# EasyEDA schematic T2_PDF_RohanKumar_B24277.json
TITLE: Sheet_1; REV: 1.0; Date: 2025-07-14; Sheet: 1/1; Drawn By: rohankumar84342; Company: Your Company
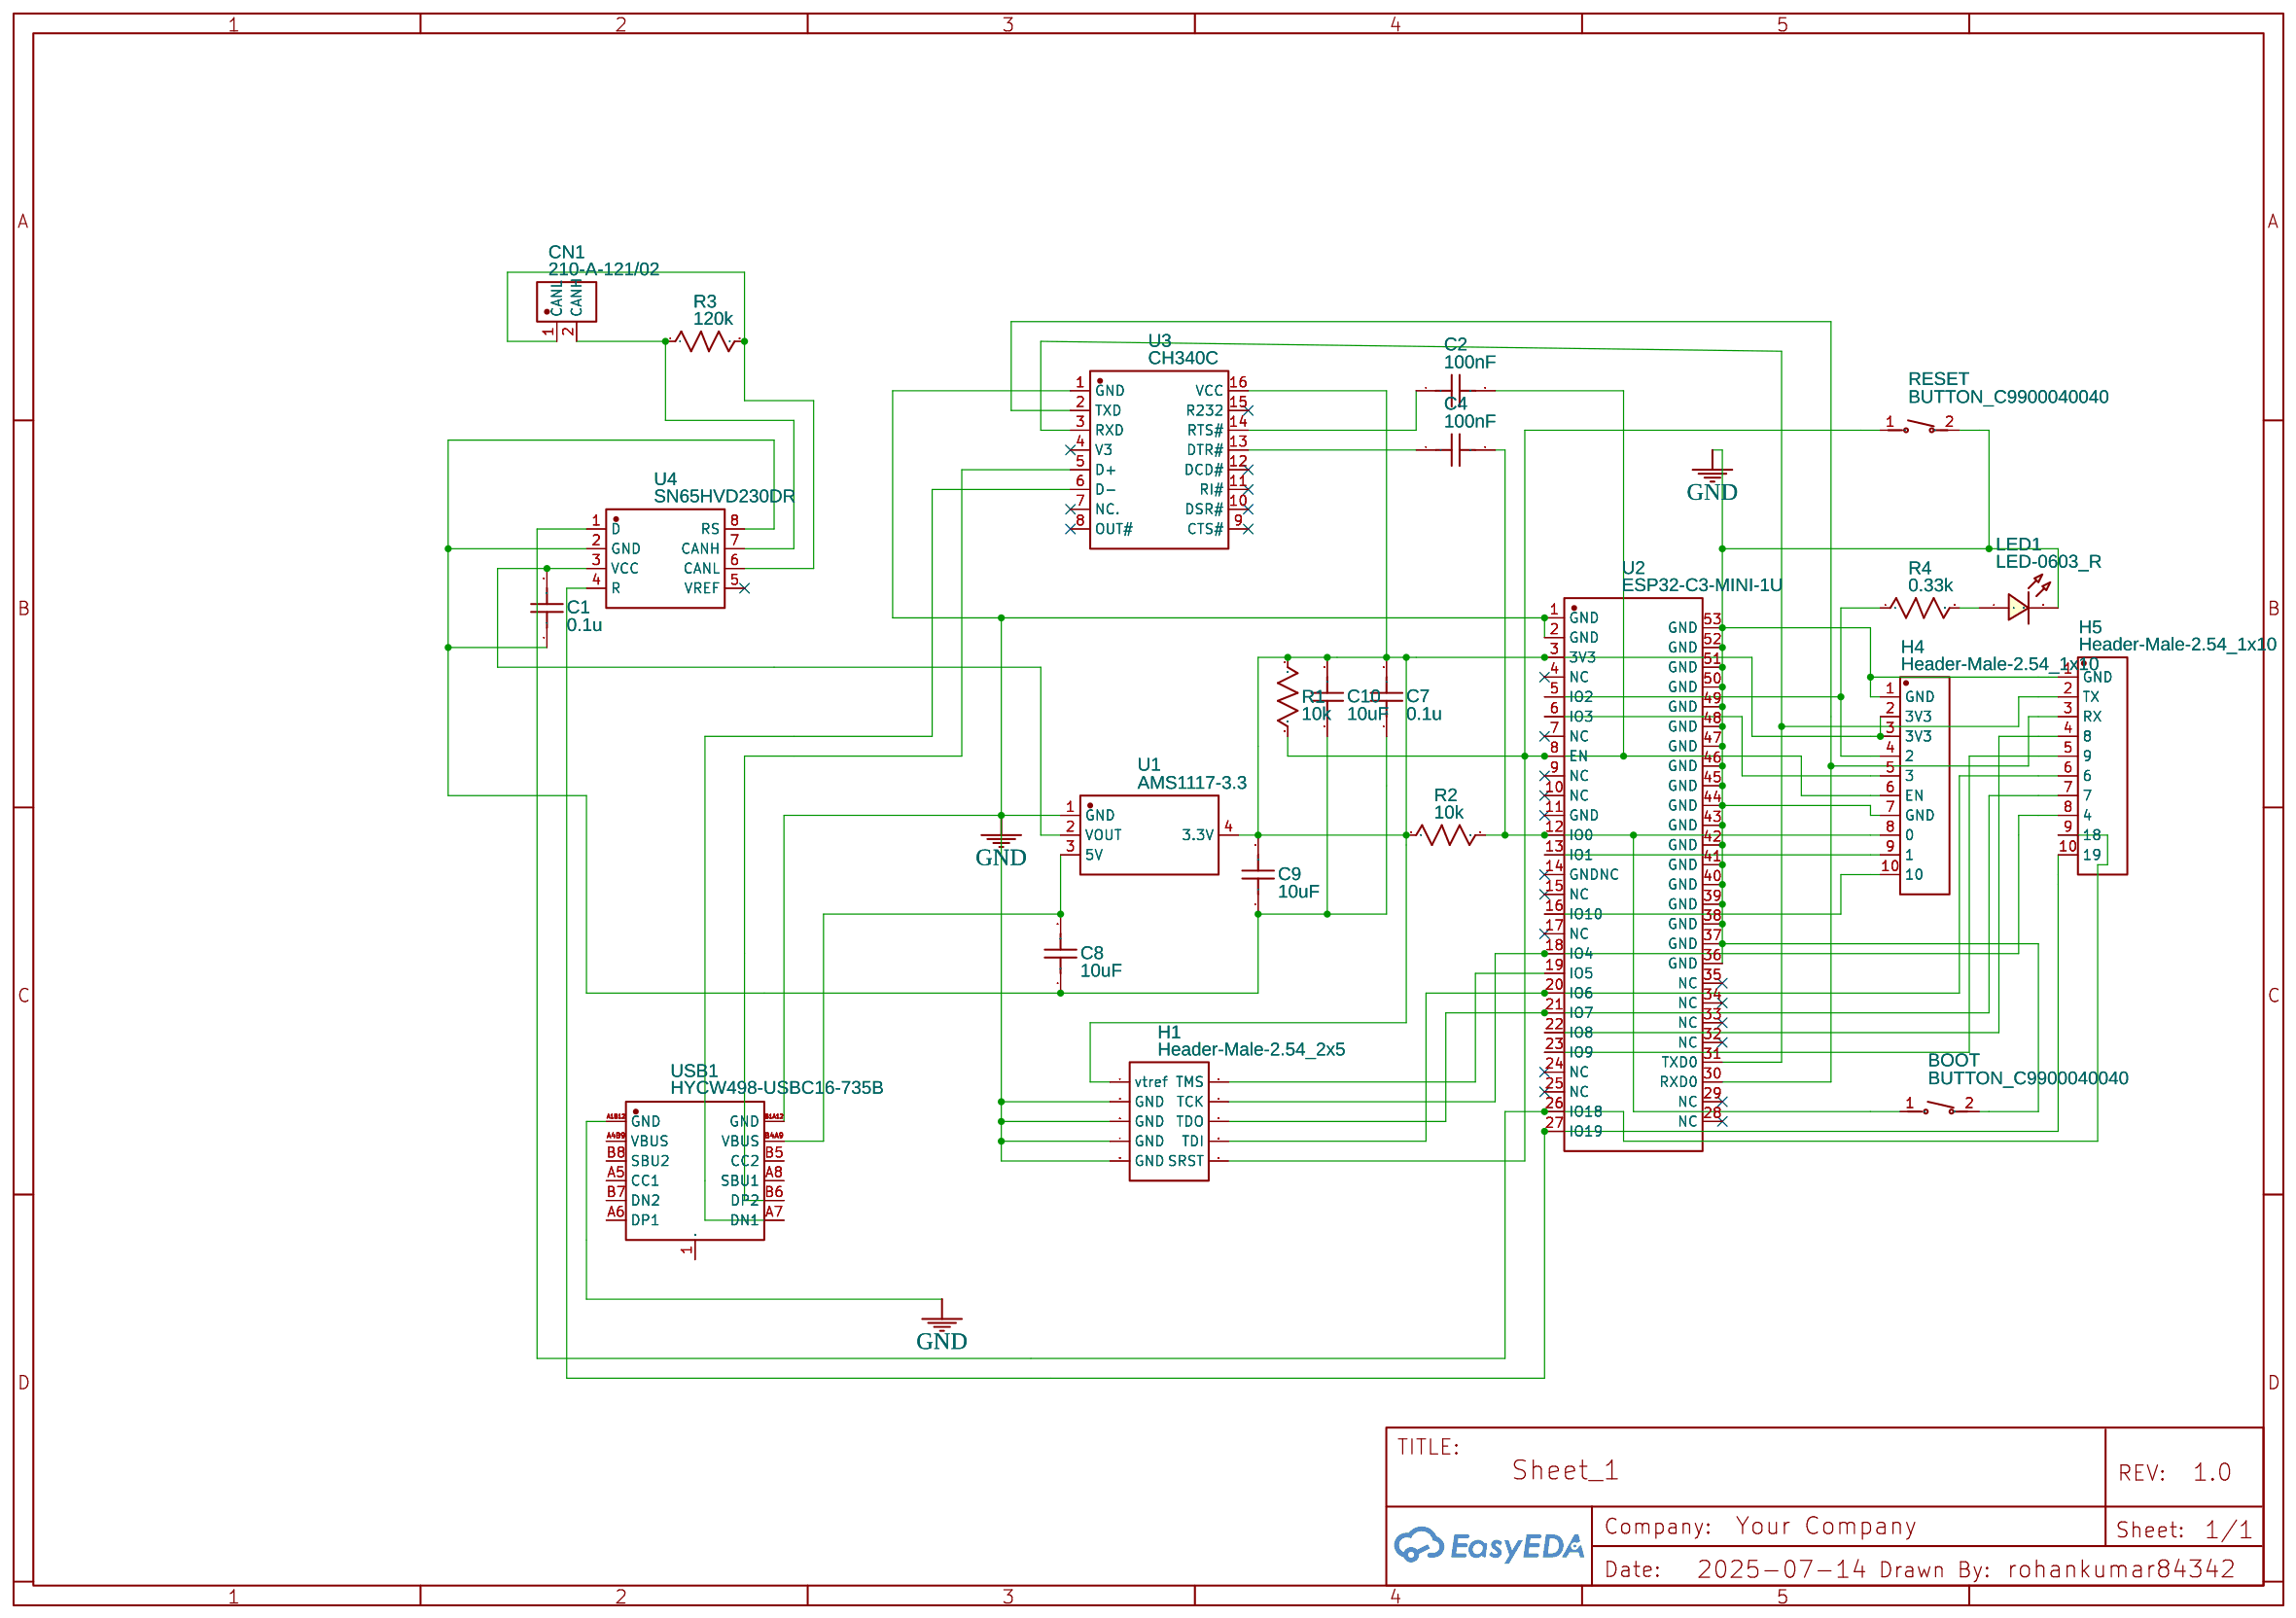
[diagram p0: schematic sheet]

## Parts
BOOT  BUTTON_C9900040040  [KEY-SMD_L6.0-W6.0-LS6.6]
C1  0.1u  [C0603]
C2  100nF  [C0603]
C4  100nF  [C0603]
C7  0.1u  [C0603]
C8  10uF  [C0603]
C9  10uF  [C0603]
C10  10uF  [C0603]
CN1  210-A-121/02  [CONN-TH_2P-P3.50_210-A-121-02]
H1  Header-Male-2.54_2x5  [HDR-TH_10P-P2.54-V-M-R2-C5-S2.54]
H4  Header-Male-2.54_1x10  [HDR-TH_10P-P2.54-V-M-1]
H5  Header-Male-2.54_1x10  [HDR-TH_10P-P2.54-V-M-1]
LED1  LED-0603_R  [LED0603_RED]
R1  10k  [R0603]
R2  10k  [R0603]
R3  120k  [R0603]
R4  0.33k  [R0603]
RESET  BUTTON_C9900040040  [KEY-SMD_L6.0-W6.0-LS6.6]
U1  AMS1117-3.3  [SOT-223-3_L6.5-W3.4-P2.30-LS7.0-BR]
U2  ESP32-C3-MINI-1U  [WIFIM-SMD_ESP32-C3-MINI-MINI-1U]
U3  CH340C  [SOP-16_L10.0-W3.9-P1.27-LS6.0-BL]
U4  SN65HVD230DR  [SOIC-8_L4.9-W3.9-P1.27-LS6.0-BL]
USB1  HYCW498-USBC16-735B  [USB-C-SMD_HYCW498-USBC16-735B]

## Library data of the parts
BOOT RESET = BUTTON_C9900040040: Contributor: lcsc; Supplier: LCSC; Supplier Part: C9900040040; Manufacturer: null; Manufacturer Part: BUTTON; JLCPCB Part Class: Extended Part
C1 C2 C4 C7-C10 = C_0603_US: Contributor: LCEDA_Lib
CN1 = 210-A-121/02: Supplier: LCSC; Supplier Part: C19108926; Manufacturer: WECO(威克德诺); Contributor: lcsc; JLCPCB Part Class: Extended Part
H1 = Header-Male-2.54_2x5: Supplier: LCSC; Manufacturer Part: 2*5p排针 2.54mm; Supplier Part: C28207; JLCPCB Part Class: Extended Part; Manufacturer: null
H4 H5 = Header-Male-2.54_1x10: Supplier: LCSC; Manufacturer Part: 2.54-1*10P针; Supplier Part: C57369; JLCPCB Part Class: Extended Part; Manufacturer: BOOMELE(博穆精密)
LED1 = LED-0603_R: Manufacturer: EVERLIGHT(台湾亿光); Manufacturer Part: 19-217/R6C-AL1M2VY/3T; Supplier Part: C72044; Supplier: LCSC; Contributor: LCEDA_01
R1-R4 = R_0603_US: Contributor: LCEDA_Lib
U1 = AMS1117-3.3: sourceId: dwIGgezVh; Supplier: LCSC; Manufacturer: AMS; Supplier Part: C6186; JLCPCB Part Class: Basic Part
U2 = ESP32-C3-MINI-1U: Contributor: LCSC; Convert to PCB: Yes; Add into BOM: Yes; Supplier: LCSC; Supplier Part: C9900000796; Manufacturer: null; JLCPCB Part Class: Extended Part
U3 = CH340C: Supplier: LCSC; Manufacturer: WCH(南京沁恒); Supplier Part: C84681; JLCPCB Part Class: Extended Part
U4 = SN65HVD230DR: Supplier: LCSC; Manufacturer: TI(德州仪器); Supplier Part: C12084; JLCPCB Part Class: Extended Part
USB1 = HYCW498-USBC16-735B: Supplier: LCSC; Supplier Part: C42400252; Manufacturer: 华宇创; Contributor: lcsc; JLCPCB Part Class: Extended Part

## Nets
GND: BOOT.2(B) H1.3(GND) H1.5(GND) H1.7(GND) H1.9(GND) H4.1(GND) H4.7(GND) H5.1(GND) LED1.2 RESET.2(B) U1.1(GND) U2.1(GND) U2.2(GND) U2.36(GND) U2.37(GND) U2.38(GND) U2.39(GND) U2.40(GND) U2.41(GND) U2.42(GND) U2.43(GND) U2.44(GND) U2.45(GND) U2.46(GND) U2.47(GND) U2.48(GND) U2.49(GND) U2.50(GND) U2.51(GND) U2.52(GND) U2.53(GND) U3.1(GND) USB1.A1B12(GND) USB1.B1A12(GND)
Net-(BOOT-1): BOOT.1(A) C4.2 H4.8(0) R2.2 U2.12(IO0)
Net-(C1-1): C1.1 C7.1 C8.1 C9.1 C10.1 U4.2(GND) U4.8(RS)
Net-(C1-2): C1.2 U1.2(VOUT) U4.3(VCC)
Net-(C2-1): C2.1 U3.14(RTS#)
Net-(C2-2): C2.2 H1.10(SRST) H4.6(EN) R1.2 RESET.1(A) U2.8(EN)
Net-(C4-1): C4.1 U3.13(DTR#)
Net-(C7-2): C7.2 C9.2 C10.2 H1.1(vtref) H4.2(3V3) H4.3(3V3) R1.1 R2.1 U1.4(3.3V) U2.3(3V3) U3.16(VCC)
Net-(C8-2): C8.2 U1.3(5V) USB1.B4A9(VBUS)
Net-(CN1-1): CN1.1(CANL) R3.2 U4.6(CANL)
Net-(CN1-2): CN1.2(CANH) R3.1 U4.7(CANH)
Net-(H1-2): H1.2(TMS) U2.19(IO5)
Net-(H1-4): H1.4(TCK) H5.8(4) U2.18(IO4)
Net-(H1-6): H1.6(TDO) H5.7 U2.21(IO7)
Net-(H1-8): H1.8(TDI) H5.6 U2.20(IO6)
Net-(H4-4): H4.4(2) R4.1 U2.5(IO2)
Net-(H4-5): H4.5(3) U2.6(IO3)
Net-(H4-9): H4.9(1) U2.13(IO1)
Net-(H4-10): H4.10 U2.16(IO10)
Net-(H5-2): H5.2(TX) U2.31(TXD0) U3.3(RXD)
Net-(H5-3): H5.3(RX) U2.30(RXD0) U3.2(TXD)
Net-(H5-4): H5.4(8) U2.22(IO8)
Net-(H5-5): H5.5(9) U2.23(IO9)
Net-(H5-9): H5.9(18) U2.26(IO18) U4.1(D)
Net-(H5-10): H5.10(19) U2.27(IO19) U4.4(R)
Net-(LED1-1): LED1.1 R4.2
Net-(U3-5): U3.5(D+) USB1.B6(DP2)
Net-(U3-6): U3.6(D-) USB1.A7(DN1)

Not connected (* = marked no-connect by the designer): U2 4(NC)* 7(NC)* 9(NC)* 10(NC)* 11(GND)* 14(GNDNC)* 15(NC)* 17(NC)* 24(NC)* 25(NC)* 28(NC)* 29(NC)* 32(NC)* 33(NC)* 34(NC)* 35(NC)*; U3 4(V3)* 7(NC.)* 8(OUT#)* 9(CTS#)* 10(DSR#)* 11(RI#)* 12(DCD#)* 15(R232)*; U4 5(VREF)*; USB1 1(SHELL) A4B9(VBUS) A5(CC1) A6(DP1) A8(SBU1) B5(CC2) B7(DN2) B8(SBU2)
